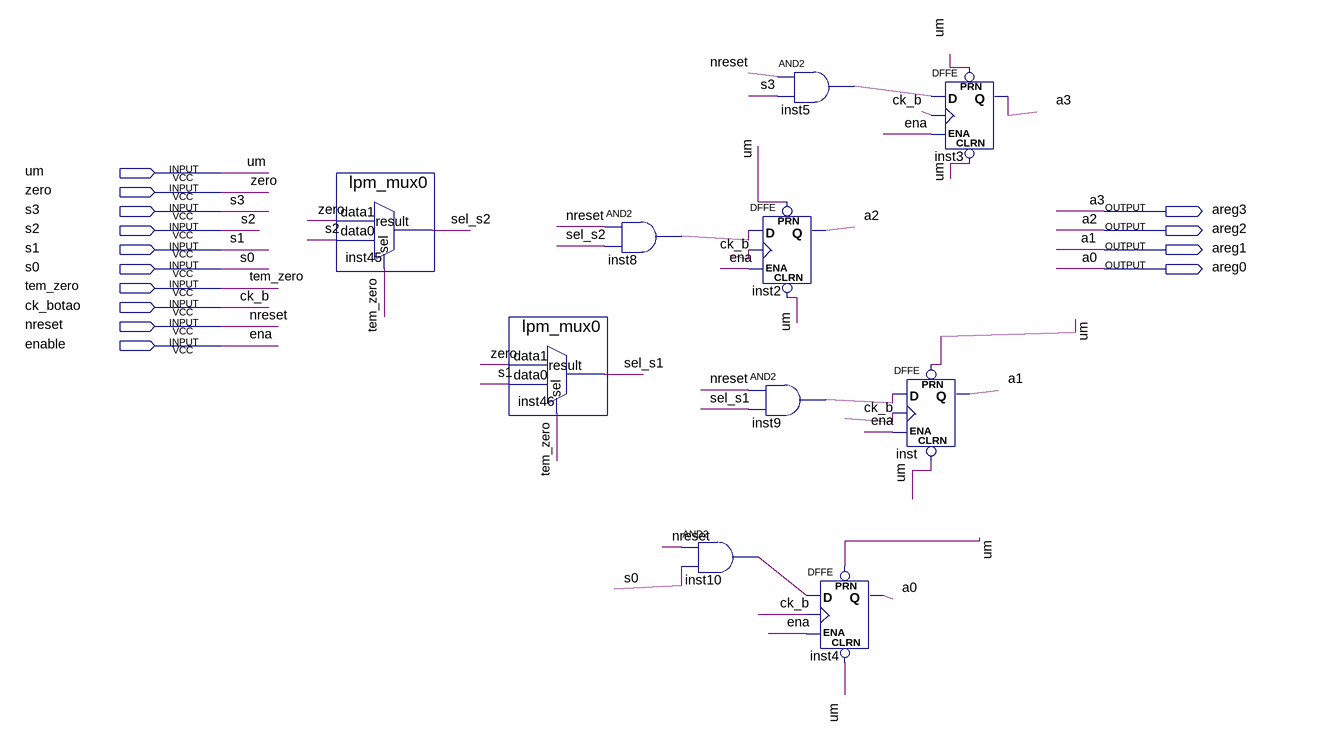
[diagram p0: schematic sheet]
// Quartus schematic registrador_display0.bdf as structural Verilog: 10 symbols, 14 pins
module registrador_display0 (
  input  um,
  input  zero,
  input  s3,
  input  s2,
  input  s1,
  input  s0,
  input  tem_zero,
  input  ck_botao,
  input  nreset,
  input  enable,
  output areg3,
  output areg2,
  output areg1,
  output areg0
);

  wire inst5_out, inst8_out, inst9_out, inst10_out, sel_s1, sel_s2;

  lpm_mux0 inst45 (.data1(zero), .data0(s2), .sel(tem_zero), .result(sel_s2));
  lpm_mux0 inst46 (.data1(zero), .data0(s1), .sel(tem_zero), .result(sel_s1));
  and inst8 (inst8_out, nreset, sel_s2);
  and inst10 (inst10_out, nreset, s0);
  DFFE inst2 (.PRN(um), .CLRN(um), .D(inst8_out), .CLK(ck_botao), .ENA(enable), .Q(areg2));
  and inst9 (inst9_out, nreset, sel_s1);
  and inst5 (inst5_out, nreset, s3);
  DFFE inst4 (.PRN(um), .CLRN(um), .D(inst10_out), .CLK(ck_botao), .ENA(enable), .Q(areg0));
  DFFE inst (.PRN(um), .CLRN(um), .D(inst9_out), .CLK(ck_botao), .ENA(enable), .Q(areg1));
  DFFE inst3 (.PRN(um), .CLRN(um), .D(inst5_out), .CLK(ck_botao), .ENA(enable), .Q(areg3));

  // Other names for the same wires on the sheet: a0 = areg0; a1 = areg1; a2 = areg2; a3 = areg3; ck_b = ck_botao;
  //   ena = enable
endmodule
